# EAGLE schematic Ocreeb MK 2 _faders half _schematic (EAGLE 9.7.0)
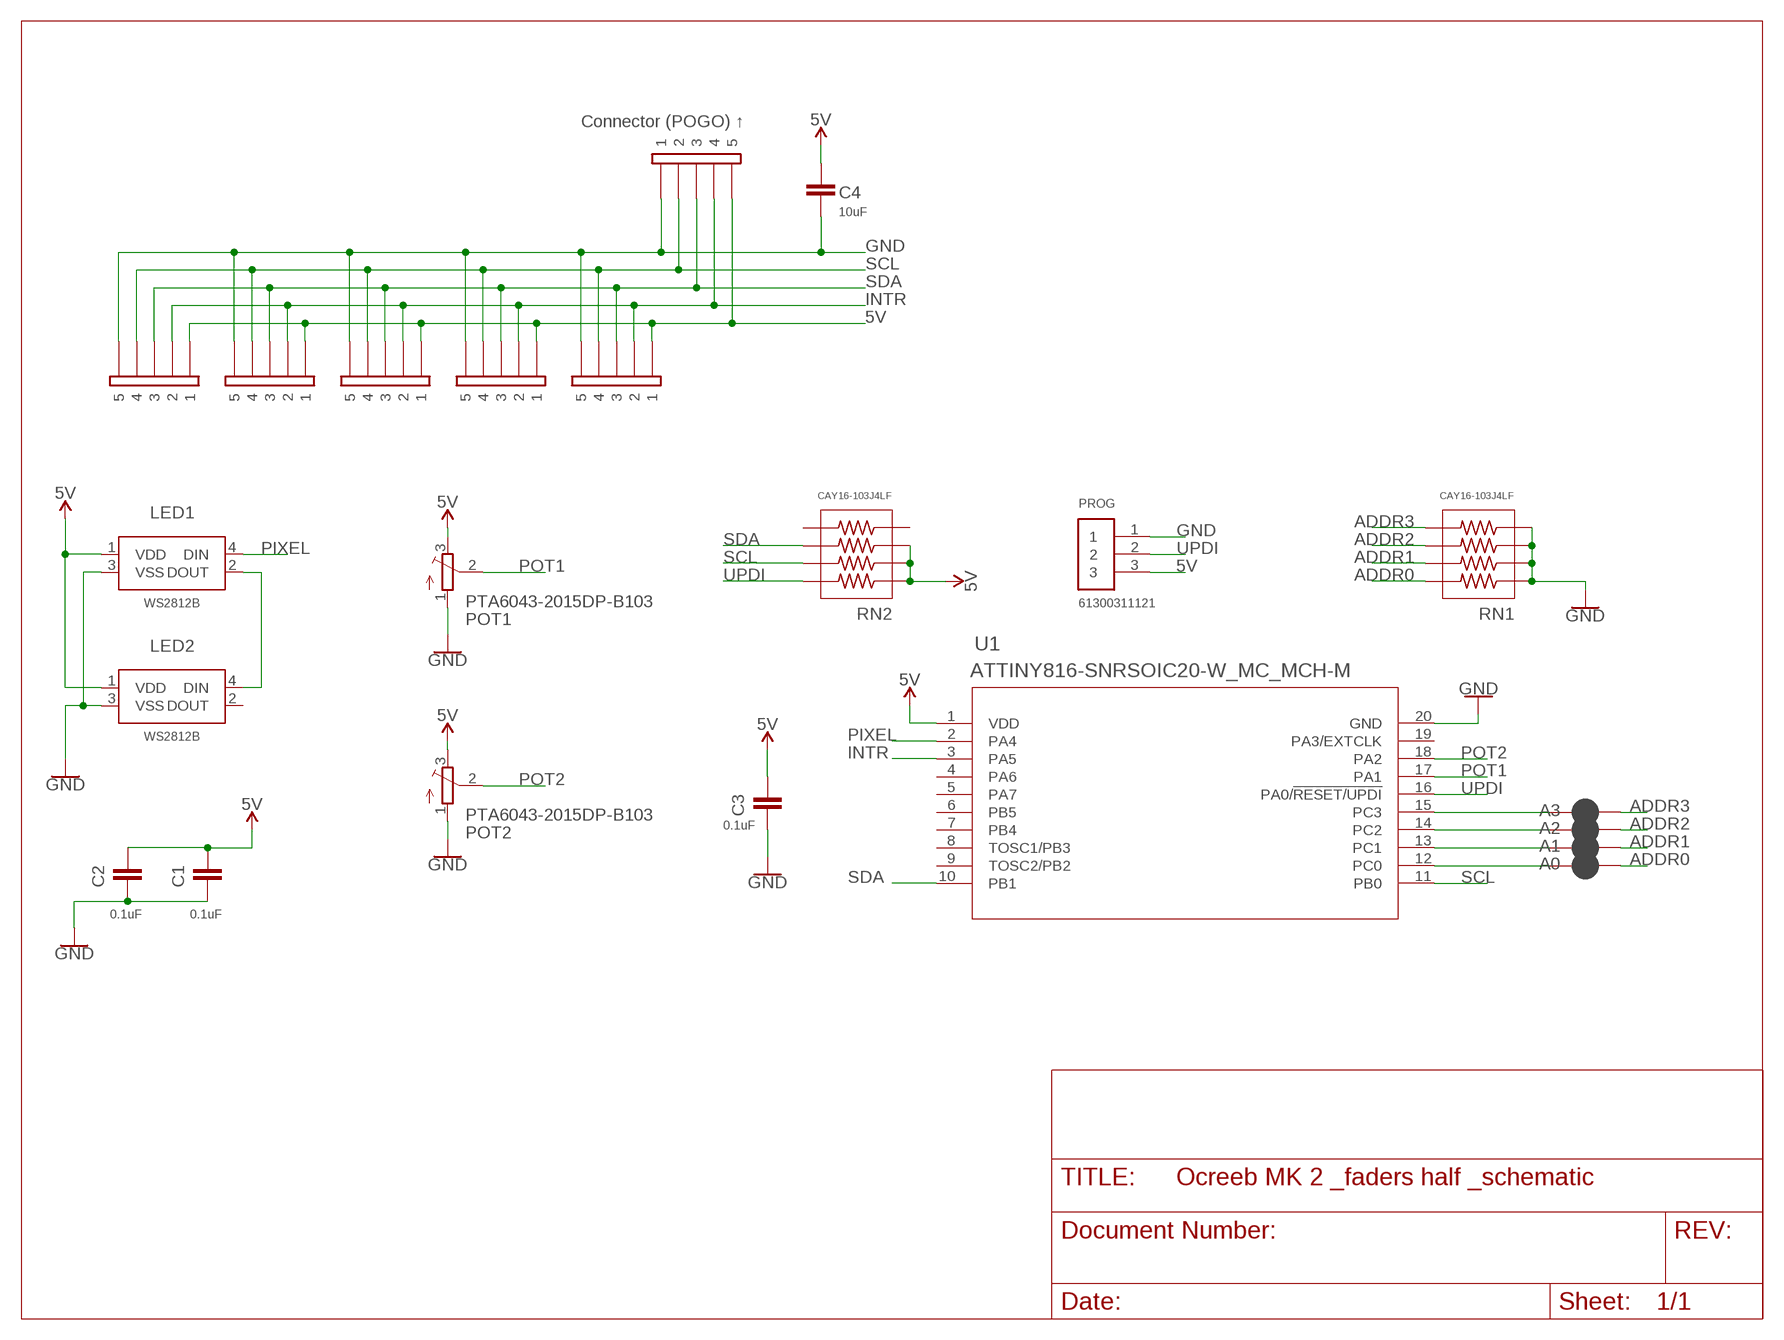
[diagram p0: schematic, sheet 1]

## Parts
A0  JUMPER-SMT_2_NC_PASTE_SILK  [SMT-JUMPER_2_NC_PASTE_SILK]
A1  JUMPER-SMT_2_NC_PASTE_SILK  [SMT-JUMPER_2_NC_PASTE_SILK]
A2  JUMPER-SMT_2_NC_PASTE_SILK  [SMT-JUMPER_2_NC_PASTE_SILK]
A3  JUMPER-SMT_2_NC_PASTE_SILK  [SMT-JUMPER_2_NC_PASTE_SILK]
C1  0.1uF  C_CHIP-0603(1608-METRIC)  [CAPC1608X85]
C2  0.1uF  C_CHIP-0603(1608-METRIC)  [CAPC1608X85]
C3  0.1uF  C_CHIP-0603(1608-METRIC)  [CAPC1608X85]
C4  10uF  C_CHIP-0805(2012-METRIC)  [CAPC2012X110]
LED1  WS2812B  [WS2812B]
LED2  WS2812B  [WS2812B]
POT1  PTA6043-2015DP-B103  [PTA6043-2015DP-B103]
POT2  PTA6043-2015DP-B103  [PTA6043-2015DP-B103]
PROG  61300311121  [61300311121]
RN1  CAY16-103J4LF  [RESCAF80P320X160X60-8N]
RN2  CAY16-103J4LF  [RESCAF80P320X160X60-8N]
U1  ATTINY816-SNRSOIC20-W_MC_MCH-M  [SOIC20-W_MC_MCH-M]
U$1  5PIN_EDGE5_POGO_EDGE_OUT_  [5_POGO_EDGE]
U$2  5PIN_EDGE  [5_POGO_EDGE]
U$3  5PIN_EDGE  [5_POGO_EDGE]
U$4  5PIN_EDGE  [5_POGO_EDGE]
U$5  5PIN_EDGE  [5_POGO_EDGE]
U$6  5PIN_EDGE  [5_POGO_EDGE]

## Nets
5V [power]: C1.2 C2.2 C3.2 C4.2 LED1.1(VDD) LED2.1(VDD) POT1.3 POT2.3 PROG.3 RN2.1 RN2.2 RN2.3 U1.1(VDD) U$1.5 U$2.1 U$3.1 U$4.1 U$5.1 U$6.1
ADDR0: A0.1 RN1.8
ADDR1: A1.1 RN1.7
ADDR2: A2.1 RN1.6
ADDR3: A3.1 RN1.5
GND [power]: C1.1 C2.1 C3.1 C4.1 LED1.3(VSS) LED2.3(VSS) POT1.1 POT2.1 PROG.1 RN1.1 RN1.2 RN1.3 RN1.4 U1.20(GND) U$1.1 U$2.5 U$3.5 U$4.5 U$5.5 U$6.5
INTR: U1.3(PA5) U$1.4 U$2.2 U$3.2 U$4.2 U$5.2 U$6.2
N$1: LED1.2(DOUT) LED2.4(DIN)
N$2: A3.2 U1.15(PC3)
N$4: A2.2 U1.14(PC2)
N$5: A1.2 U1.13(PC1)
N$6: A0.2 U1.12(PC0)
PIXEL: LED1.4(DIN) U1.2(PA4)
POT1: POT1.2 U1.17(PA1)
POT2: POT2.2 U1.18(PA2)
SCL: RN2.7 U1.11(PB0) U$1.2 U$2.4 U$3.4 U$4.4 U$5.4 U$6.4
SDA: RN2.6 U1.10(PB1) U$1.3 U$2.3 U$3.3 U$4.3 U$5.3 U$6.3
UPDI: PROG.2 RN2.8 U1.16(PA0/!RESET/UPDI)
Unconnected: LED2.2(DOUT) POT1.S1(S) POT1.S2(S) POT1.S3(S) POT1.S4(S) POT2.S1(S) POT2.S2(S) POT2.S3(S) POT2.S4(S) RN2.4 RN2.5 U1.4(PA6) U1.5(PA7) U1.6(PB5) U1.7(PB4) U1.8(TOSC1/PB3) U1.9(TOSC2/PB2) U1.19(PA3/EXTCLK)

## Notes on the sheet
- Connector (POGO) ↑

## Library data of the parts
A0 A1-A3 = SparkFun-Jumpers:JUMPER-SMT_2_NC_PASTE: Normally closed solder jumper This jumper has an aperture in the stencil to allow solder paste to bridge the split in the wire so it's normally closed (NC). Wick off the solder to open the connection. Reapply solder to reclose the connection.
C1-C4 = Capacitor:C: Capacitor - Generic; CATEGORY: Capacitor
LED1 LED2 = WS2812B:WS2812B: Intelligent control LED integrated light source Datasheet <http://cdn.sparkfun.com/datasheets/BreakoutBoards/WS2812B.pdf>; CATEGORY: LED; COLOR: RGB; DESCRIPTION: LED integrated light source; MANUFACTURER: Worldsemi; MPN: WS2812B; OPERATING_TEMP: -25 ℃ to +80℃(TJ); PART_STATUS: Active; SUB_CATEGORY: RGB
POT1 POT2 = PTA6043-2015DP-B103:PTA6043-2015DP-B103: Slide potentiometer Check availability <https://pricing.snapeda.com/parts/PTA6043-2015DPB103/Bourns/view-part?ref=eda>; AVAILABILITY: In Stock; CHECK_PRICES: https://www.snapeda.com/parts/PTA6043-2015DPB103/Bourns/view-part/?ref=eda; DESCRIPTION: PTA Series, Linear Potentiometer, 10kOhms, +/-20%, 0.25W, Through Hole | Bourns PTA6043-2015DPB103; MF: Bourns; MP: PTA6043-2015DPB103; PACKAGE: None; PRICE: None; PURCHASE-URL: https://www.snapeda.com/api/url_track_click_mouser/?unipart_id=584779&manufacturer=Bourns&part_name=PTA6043-2015DPB103&search_term=pta6043-2015dpb103; SNAPEDA_LINK: https://www.snapeda.com/parts/PTA6043-2015DPB103/Bourns/view-part/?ref=snap
PROG = Headers:61300311121: CONN HEADER VERT 3POS 2.54MM Manufacturer's datasheet <https://katalog.we-online.de/em/datasheet/6130xx11121.pdf>; CREATED_BY: PCBLayout.com; DIGI_KEY_PART_NUMBER: 732-5316-ND; MANUFACTURER: Wurth Electronics Inc.; MPN: 61300311121
RN1 RN2 = CAY16-103J4LF:CAY16-103J4LF: Res Thick Film Array 75 Ohm 5% 0.25W(1/4W) ?200ppm/C ISOL Molded 8-Pin 1206(4 X 0603) Convex SMD T/R; CHECK_PRICES: https://www.snapeda.com/parts/CAY16-103J4LF/Bourns+-+J.W.+Miller/view-part/?ref=eda; DESCRIPTION: Resistor, Chip Array,10 Kilohms,62 mW,+ 5%,50 V (Max.) | Bourns CAY16-103J4LF; DIGIKEY_PART_NUMBER: CAY16-103J4LFTR-ND; MF: Bourns; MP: CAY16-103J4LF; PACKAGE: 1206 Bourns; PURCHASE-URL: https://www.snapeda.com/api/url_track_click_mouser/?unipart_id=47136&manufacturer=Bourns&part_name=CAY16-103J4LF&search_term=None; SNAPEDA_LINK: https://www.snapeda.com/parts/CAY16-103J4LF/Bourns+-+J.W.+Miller/view-part/?ref=snap
U1 = Attiny816:ATTINY816-SNR; COPYRIGHT: Copyright (C) 2023 Ultra Librarian. All rights reserved.; DIGI-KEY_PART_NUMBER_1: ATTINY816-SNRCT-ND; DIGI-KEY_PART_NUMBER_2: ATTINY816-SNRDKR-ND; DIGI-KEY_PART_NUMBER_3: ATTINY816-SNRTR-ND; MANUFACTURER_PART_NUMBER: ATTINY816-SNR; MFR_NAME: Microchip
U$1-U$6 = OCREEB_POGO_CON:5PIN_EDGE

## Net classes
0 default: width 0.203 mm, drill 0.381 mm, clearance 0.152 mm
1 power: width 0.457 mm, drill 0.381 mm, clearance 0.152 mm